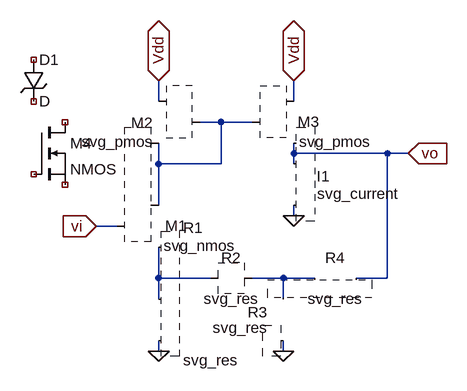
[diagram p0: schematic example.asc]
example.asc, the LTspice schematic file:
Version 4
SHEET 1 1120 680
WIRE -1008 128 -1008 96
WIRE -800 128 -800 96
WIRE -912 160 -944 160
WIRE -864 160 -912 160
WIRE -800 208 -800 192
WIRE -656 208 -800 208
WIRE -624 208 -656 208
WIRE -1008 224 -1008 192
WIRE -912 224 -912 160
WIRE -912 224 -1008 224
WIRE -800 224 -800 208
WIRE -1008 288 -1008 224
WIRE -800 304 -800 288
WIRE -1072 320 -1104 320
WIRE -1008 400 -1008 352
WIRE -928 400 -1008 400
WIRE -816 400 -864 400
WIRE -768 400 -816 400
WIRE -656 400 -656 208
WIRE -656 400 -704 400
WIRE -1008 432 -1008 400
WIRE -816 432 -816 400
WIRE -1008 512 -1008 496
WIRE -816 512 -816 496
FLAG -800 96 Vdd
IOPIN -800 96 BiDir
FLAG -1008 96 Vdd
IOPIN -1008 96 BiDir
FLAG -800 304 0
FLAG -624 208 vo
IOPIN -624 208 In
FLAG -1104 320 vi
IOPIN -1104 320 In
FLAG -816 512 0
FLAG -1008 512 0
SYMBOL svg_pmos -864 112 R0
WINDOW 0 70 47 Left 2
SYMATTR InstName M3
SYMBOL svg/svg_nmos -1072 272 R0
WINDOW 0 74 47 Left 2
SYMATTR InstName M1
SYMBOL svg_pmos -944 112 M0
WINDOW 0 72 49 Left 2
SYMATTR InstName M2
SYMBOL svg/svg_current -800 224 R0
WINDOW 0 35 19 Left 2
WINDOW 3 36 46 Left 2
SYMATTR InstName I1
SYMATTR Value ""
SYMBOL svg\\svg_res -1024 432 R0
SYMATTR InstName R1
SYMBOL svg\\svg_res -864 384 R90
WINDOW 0 0 32 VBottom 2
WINDOW 3 32 32 VTop 2
SYMATTR InstName R2
SYMBOL svg\\svg_res -800 496 R180
WINDOW 0 40 44 Left 2
WINDOW 3 40 20 Left 2
SYMATTR InstName R3
SYMBOL svg\\svg_res -768 416 R270
WINDOW 0 32 32 VTop 2
WINDOW 3 0 32 VBottom 2
SYMATTR InstName R4
SYMBOL nmos -1200 160 R0
SYMATTR InstName M4
SYMBOL zener -1216 64 R0
SYMATTR InstName D1

The netlist it stands for:
* example.asc
* M3: svg_pmos (symbol svg_pmos not available, pin order unknown); nets seen at it: N001, Vdd
* M1: svg_nmos (symbol svg/svg_nmos not available, pin order unknown); nets seen at it: N001, vi
* M2: svg_pmos (symbol svg_pmos not available, pin order unknown); nets seen at it: N001, Vdd
* I1: svg_current (symbol svg/svg_current not available, pin order unknown); nets seen at it: 0, vo
* R1: svg_res (symbol svg\svg_res not available, pin order unknown); nets seen at it: 0, N002
* R2: svg_res (symbol svg\svg_res not available, pin order unknown); nets seen at it: N002, N003
* R3: svg_res (symbol svg\svg_res not available, pin order unknown); nets seen at it: 0
* R4: svg_res (symbol svg\svg_res not available, pin order unknown); nets seen at it: N003, vo
M4 NC_01 NC_02 NC_03 NC_03 NMOS
D1 NC_04 NC_05 D
.model D D
.lib standard.dio
.model NMOS NMOS
.model PMOS PMOS
.lib standard.mos
.backanno
.end